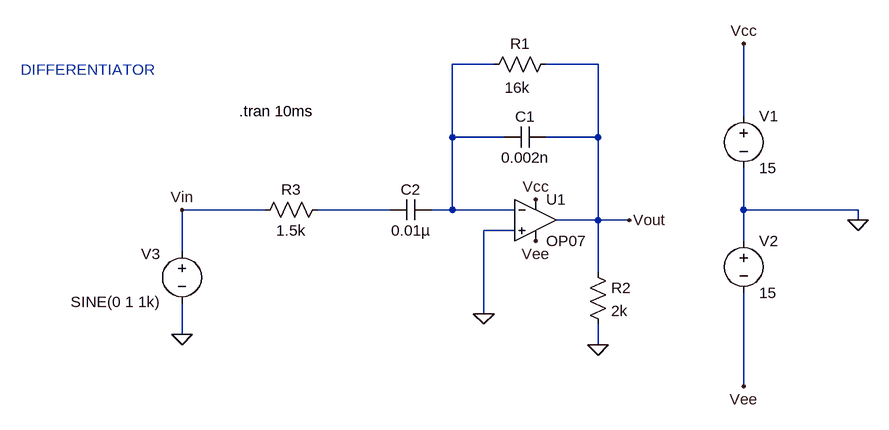
[diagram p0: schematic Differentiator(sinewave).asc]
Differentiator(sinewave).asc, the LTspice schematic file:
Version 4
SHEET 1 880 680
WIRE 112 -96 48 -96
WIRE 272 -96 192 -96
WIRE 496 -16 496 -128
WIRE 48 16 48 -96
WIRE 128 16 48 16
WIRE 272 16 272 -96
WIRE 272 16 192 16
WIRE -240 128 -368 128
WIRE -48 128 -160 128
WIRE 48 128 48 16
WIRE 48 128 16 128
WIRE 144 128 48 128
WIRE 496 128 496 64
WIRE 672 128 496 128
WIRE 272 144 272 16
WIRE 272 144 208 144
WIRE 320 144 272 144
WIRE 672 144 672 128
WIRE 144 160 96 160
WIRE 496 176 496 128
WIRE -368 192 -368 128
WIRE 272 224 272 144
WIRE 96 288 96 160
WIRE -368 320 -368 272
WIRE 272 336 272 304
WIRE 496 400 496 256
FLAG 96 288 0
FLAG 272 336 0
FLAG -368 320 0
FLAG 672 144 0
FLAG 176 112 Vcc
FLAG 176 176 Vee
FLAG 496 400 Vee
FLAG 496 -128 Vcc
FLAG 320 144 Vout
FLAG -368 128 Vin
SYMBOL OpAmps\\OP07 176 80 R0
SYMATTR InstName U1
SYMBOL res 208 -112 R90
WINDOW 0 0 56 VBottom 2
WINDOW 3 36 60 VTop 2
SYMATTR InstName R1
SYMATTR Value 16k
SYMBOL cap 192 0 R90
WINDOW 0 0 32 VBottom 2
WINDOW 3 32 32 VTop 2
SYMATTR InstName C1
SYMATTR Value 0.002n
SYMBOL res 256 208 R0
SYMATTR InstName R2
SYMATTR Value 2k
SYMBOL voltage 496 -32 R0
SYMATTR InstName V1
SYMATTR Value 15
SYMBOL voltage 496 160 R0
SYMATTR InstName V2
SYMATTR Value 15
SYMBOL voltage -368 176 R0
WINDOW 123 0 0 Left 0
WINDOW 39 0 0 Left 0
WINDOW 0 -63 20 Left 2
WINDOW 3 -171 94 Left 2
SYMATTR InstName V3
SYMATTR Value SINE(0 1 1k)
SYMBOL res -144 112 R90
WINDOW 0 0 56 VBottom 2
WINDOW 3 32 56 VTop 2
SYMATTR InstName R3
SYMATTR Value 1.5k
SYMBOL cap 16 112 R90
WINDOW 0 0 32 VBottom 2
WINDOW 3 32 32 VTop 2
SYMATTR InstName C2
SYMATTR Value 0.01µ
TEXT -280 -24 Left 2 !.tran 10ms
TEXT -616 -88 Left 2 ;DIFFERENTIATOR

The netlist it stands for:
* Differentiator(sinewave).asc
XU1 0 N001 Vcc Vee Vout LT1001  ; OP07, pins In+ In- V+ V- OUT
R1 Vout N001 16k
C1 Vout N001 0.002n
R2 Vout 0 2k
V1 Vcc 0 15
V2 0 Vee 15
V3 Vin 0 SINE(0 1 1k)
R3 N002 Vin 1.5k
C2 N001 N002 0.01µ
.tran 10ms
* DIFFERENTIATOR
.lib LTC.lib
.backanno
.end